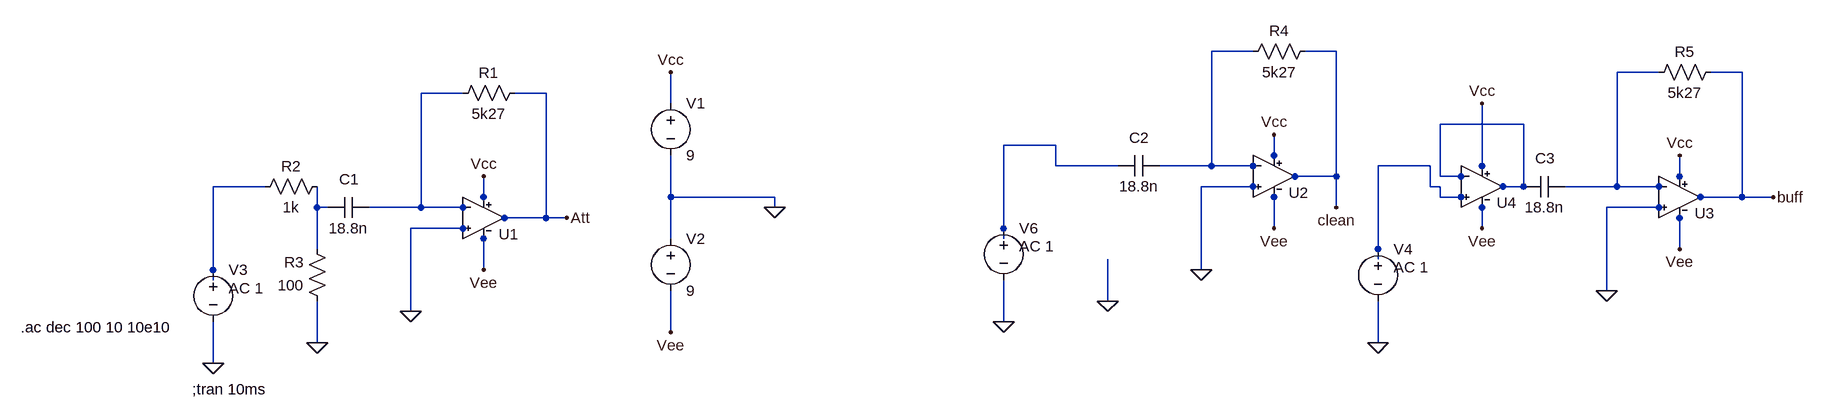
[diagram p0: schematic Derivador.asc]
Derivador.asc, the LTspice schematic file:
Version 4
SHEET 1 2672 680
WIRE 1808 -192 1744 -192
WIRE 1936 -192 1888 -192
WIRE 2432 -160 2368 -160
WIRE 2560 -160 2512 -160
WIRE 592 -128 528 -128
WIRE 720 -128 672 -128
WIRE 912 -112 912 -160
WIRE 2224 -80 2096 -80
WIRE 1504 -48 1424 -48
WIRE 1840 -32 1840 -64
WIRE 1504 -16 1504 -48
WIRE 1600 -16 1504 -16
WIRE 1744 -16 1744 -192
WIRE 1744 -16 1664 -16
WIRE 1808 -16 1744 -16
WIRE 2080 -16 2000 -16
WIRE 2160 -16 2160 -112
WIRE 1936 0 1936 -192
WIRE 1936 0 1872 0
WIRE 2096 0 2096 -80
WIRE 2128 0 2096 0
WIRE 2464 0 2464 -32
WIRE 288 16 208 16
WIRE 1808 16 1728 16
WIRE 2080 16 2080 -16
WIRE 2096 16 2080 16
WIRE 2224 16 2224 -80
WIRE 2224 16 2192 16
WIRE 2368 16 2368 -160
WIRE 2368 16 2288 16
WIRE 2432 16 2368 16
WIRE 624 32 624 0
WIRE 912 32 912 -32
WIRE 1072 32 912 32
WIRE 2096 32 2096 16
WIRE 2128 32 2096 32
WIRE 2560 32 2560 -160
WIRE 2560 32 2496 32
WIRE 2608 32 2560 32
WIRE 368 48 368 16
WIRE 384 48 368 48
WIRE 528 48 528 -128
WIRE 528 48 448 48
WIRE 592 48 528 48
WIRE 1072 48 1072 32
WIRE 1936 48 1936 0
WIRE 2432 48 2352 48
WIRE 720 64 720 -128
WIRE 720 64 656 64
WIRE 752 64 720 64
WIRE 592 80 512 80
WIRE 1424 80 1424 -48
WIRE 1840 80 1840 32
WIRE 2160 80 2160 48
WIRE 912 96 912 32
WIRE 1424 96 1424 80
WIRE 368 112 368 48
WIRE 2000 112 2000 -16
WIRE 2464 112 2464 64
WIRE 2000 128 2000 112
WIRE 208 144 208 16
WIRE 624 144 624 96
WIRE 1728 144 1728 16
WIRE 208 160 208 144
WIRE 2352 176 2352 48
WIRE 1584 192 1584 128
WIRE 512 208 512 80
WIRE 1424 224 1424 160
WIRE 912 240 912 176
WIRE 368 256 368 192
WIRE 2000 256 2000 192
WIRE 208 288 208 224
FLAG 208 288 0
FLAG 1072 48 0
FLAG 512 208 0
FLAG 912 -160 Vcc
FLAG 624 0 Vcc
FLAG 912 240 Vee
FLAG 624 144 Vee
FLAG 368 256 0
FLAG 1424 224 0
FLAG 1728 144 0
FLAG 1840 -64 Vcc
FLAG 1840 80 Vee
FLAG 1584 192 0
FLAG 2000 256 0
FLAG 2352 176 0
FLAG 2464 -32 Vcc
FLAG 2464 112 Vee
FLAG 2160 -112 Vcc
FLAG 2160 80 Vee
FLAG 752 64 Att
FLAG 1936 48 clean
FLAG 2608 32 buff
SYMBOL res 688 -144 R90
WINDOW 0 0 56 VBottom 2
WINDOW 3 32 56 VTop 2
SYMATTR InstName R1
SYMATTR Value 5k27
SYMBOL cap 448 32 R90
WINDOW 0 -12 31 VBottom 2
WINDOW 3 32 32 VTop 2
SYMATTR InstName C1
SYMATTR Value 18.8n
SYMBOL voltage 912 -128 R0
WINDOW 123 0 0 Left 0
WINDOW 39 0 0 Left 0
SYMATTR InstName V1
SYMATTR Value 9
SYMBOL voltage 912 80 R0
WINDOW 123 0 0 Left 0
WINDOW 39 0 0 Left 0
SYMATTR InstName V2
SYMATTR Value 9
SYMBOL voltage 208 128 R0
WINDOW 123 24 44 Left 2
WINDOW 39 0 0 Left 0
SYMATTR Value2 AC 1
SYMATTR InstName V3
SYMATTR Value ""
SYMBOL Germosymb\\LM833 624 64 R0
SYMATTR InstName U1
SYMBOL res 384 0 R90
WINDOW 0 0 56 VBottom 2
WINDOW 3 32 56 VTop 2
SYMATTR InstName R2
SYMATTR Value 1k
SYMBOL res 384 208 R180
WINDOW 0 36 76 Left 2
WINDOW 3 36 40 Left 2
SYMATTR InstName R3
SYMATTR Value 100
SYMBOL res 1904 -208 R90
WINDOW 0 0 56 VBottom 2
WINDOW 3 32 56 VTop 2
SYMATTR InstName R4
SYMATTR Value 5k27
SYMBOL cap 1664 -32 R90
WINDOW 0 -12 31 VBottom 2
WINDOW 3 32 32 VTop 2
SYMATTR InstName C2
SYMATTR Value 18.8n
SYMBOL voltage 1424 64 R0
WINDOW 123 24 44 Left 2
WINDOW 39 0 0 Left 0
SYMATTR Value2 AC 1
SYMATTR InstName V6
SYMATTR Value ""
SYMBOL Germosymb\\LM833 1840 0 R0
SYMATTR InstName U2
SYMBOL res 2528 -176 R90
WINDOW 0 0 56 VBottom 2
WINDOW 3 32 56 VTop 2
SYMATTR InstName R5
SYMATTR Value 5k27
SYMBOL cap 2288 0 R90
WINDOW 0 -12 31 VBottom 2
WINDOW 3 32 32 VTop 2
SYMATTR InstName C3
SYMATTR Value 18.8n
SYMBOL voltage 2000 96 R0
WINDOW 123 24 44 Left 2
WINDOW 39 0 0 Left 0
SYMATTR Value2 AC 1
SYMATTR InstName V4
SYMATTR Value ""
SYMBOL Germosymb\\LM833 2464 32 R0
SYMATTR InstName U3
SYMBOL Germosymb\\LM833 2160 16 R0
SYMATTR InstName U4
TEXT 176 328 Left 2 !;tran 10ms
TEXT -88 232 Left 2 !.ac dec 100 10 10e10

The netlist it stands for:
* Derivador.asc
R1 Att N003 5k27
C1 N003 N008 18.8n
V1 Vcc 0 9
V2 0 Vee 9
V3 N007 0 AC 1
XU1 0 0 N003 N003 Vcc Vcc Vee Vee Att Att LM833 LM833 Avol=316.2K GBW=15Meg Slew=5Meg ilimit=25m rail=0 Vos=0 phimargin=60 en=0 enk=0 in=0 ink=0 Rin=175K  ; pins In+ In+ In- In- V+ V+ V- V- OUT OUT
R2 N008 N007 1k
R3 0 N008 100
R4 clean N001 5k27
C2 N001 N005 18.8n
V6 N005 0 AC 1
XU2 0 0 N001 N001 Vcc Vcc Vee Vee clean clean LM833 LM833 Avol=316.2K GBW=15Meg Slew=5Meg ilimit=25m rail=0 Vos=0 phimargin=60 en=0 enk=0 in=0 ink=0 Rin=175K  ; pins In+ In+ In- In- V+ V+ V- V- OUT OUT
R5 buff N002 5k27
C3 N002 N004 18.8n
V4 N006 0 AC 1
XU3 0 0 N002 N002 Vcc Vcc Vee Vee buff buff LM833 LM833 Avol=316.2K GBW=15Meg Slew=5Meg ilimit=25m rail=0 Vos=0 phimargin=60 en=0 enk=0 in=0 ink=0 Rin=175K  ; pins In+ In+ In- In- V+ V+ V- V- OUT OUT
XU4 N006 N006 N004 N004 Vcc Vcc Vee Vee N004 N004 LM833 LM833 Avol=316.2K GBW=15Meg Slew=5Meg ilimit=25m rail=0 Vos=0 phimargin=60 en=0 enk=0 in=0 ink=0 Rin=175K  ; pins In+ In+ In- In- V+ V+ V- V- OUT OUT
;tran 10ms
.ac dec 100 10 10e10
.lib nico/LM833.sub
.backanno
.end